# Altium project DIO_MCX.PrjPCB (part 1 of 2)
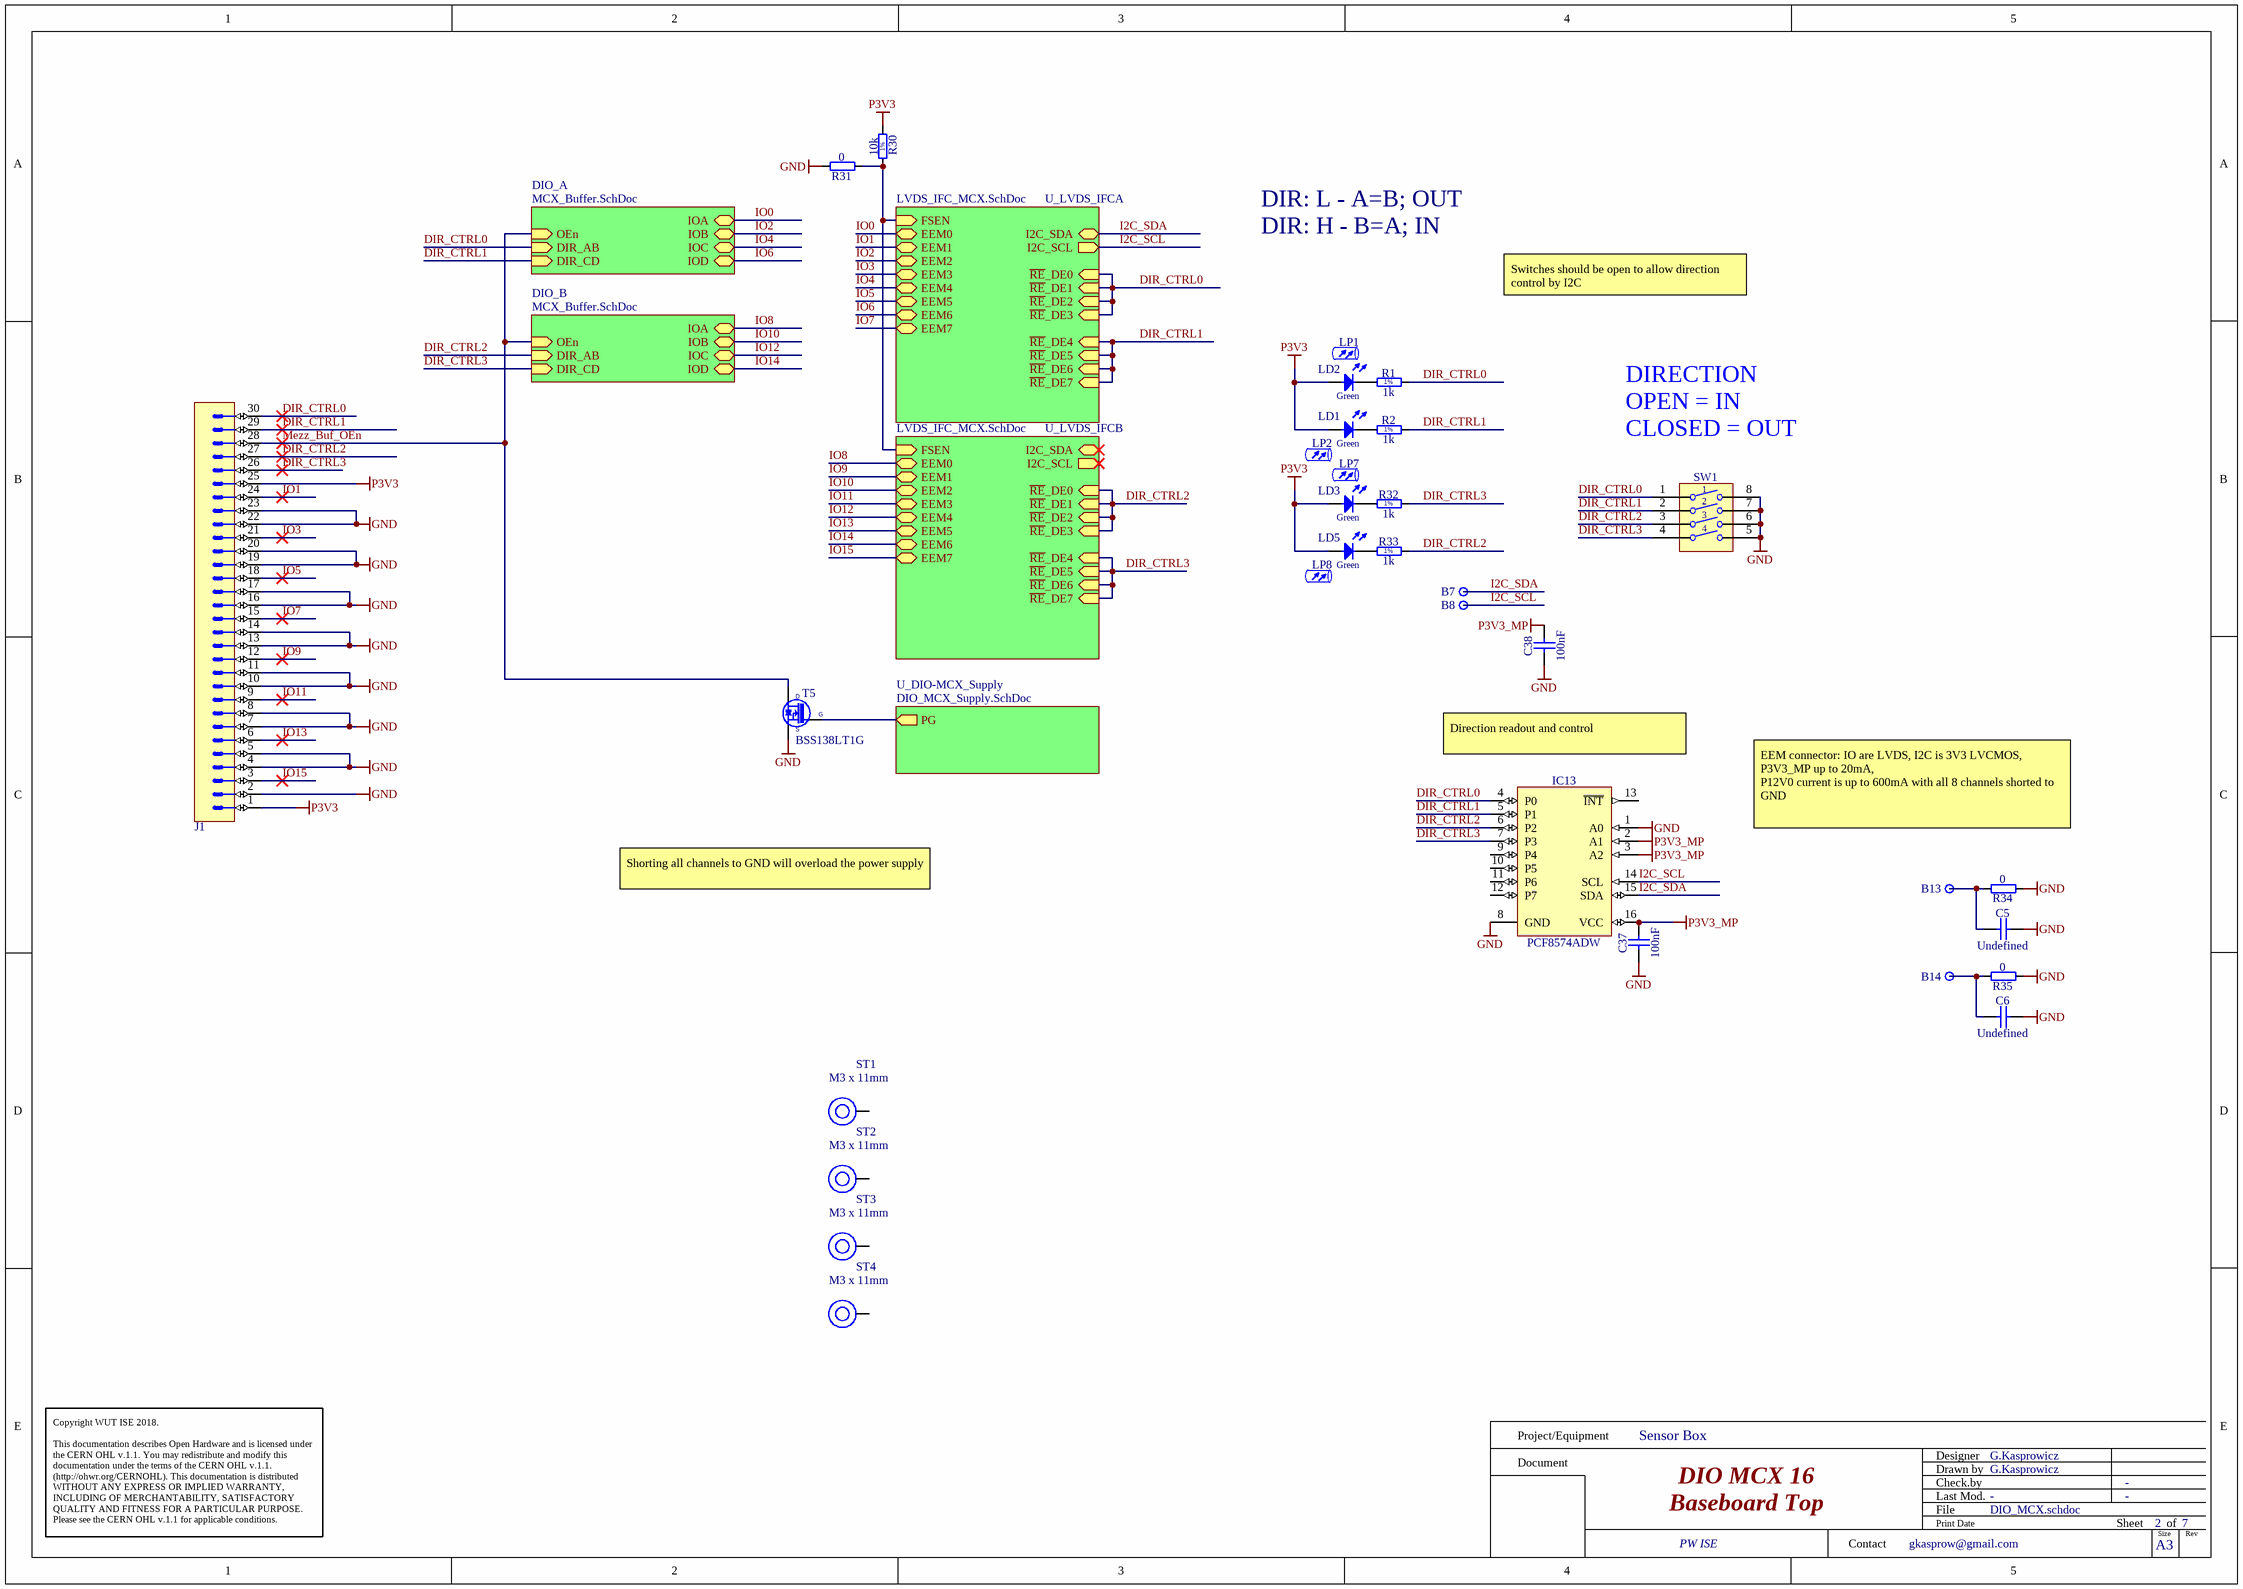
[diagram p0: DIO_MCX.schdoc]
P_version: 1.2.1
4 sheets, 224 parts. Net scope: hierarchical (ports join the sheet entries above them; power ports are global).
Board file: DIO_MCX.PCBDOC
Sheets:
  DIO_MCX.schdoc
    U_DIO-MCX_Supply = DIO_MCX_Supply.SchDoc
    U_LVDS_IFCA = LVDS_IFC_MCX.SchDoc
    U_LVDS_IFCB = LVDS_IFC_MCX.SchDoc
    DIO_A = MCX_Buffer.SchDoc
    DIO_B = MCX_Buffer.SchDoc

## Sheet DIO_MCX.schdoc: DIO MCX 16
size 420 x 297 mm; EDA_Number: ARTIQ; Projet: ARTIQ/SINARA Kasli Subsystem; Author: G.Kasprowicz; CompanyName: WUT ISE; DrawnBy: G.Kasprowicz; Organization: WUT ISE; Address1: PW ISE; Address2: Nowowiejska 15/19 00-665 Warsaw; Address3: gkasprow@gmail.com; DocumentNumber: 2; Revision: 1.2.1; SheetNumber: 2; SheetTotal: 7; ModifiedBy: -; CheckedDate: -; Title2: Baseboard Top; DivGrp: WUT ISE; Designer: G.Kasprowicz; ModifiedDate: -; ProjectName: Sensor Box

### Parts
B7  Plated Hole  [c130h60]  (value not drawn)
B8  Plated Hole  [c130h60]  (value not drawn)
B13  Plated Hole  [MTG270_500]  (value not drawn)
B14  Plated Hole  [MTG270_500]  (value not drawn)
C5  Undefined  [CAPC2012X135N]
C6  Undefined  [CAPC2012X135N]
C37  100nF  [CAPC1005X55N]
C38  100nF  [CAPC1005X55N]
IC13  PCF8574ADW  [SOIC127P1030X265-16N]
J1  (no value)  [3M_N2530-6002RB]
LD1  Green  [LED_DIALIGHT_551-1307F]
LD2  Green  [LED_DIALIGHT_551-1307F]
LD3  Green  [LED_DIALIGHT_551-1307F]
LD5  Green  [LED_DIALIGHT_551-1307F]
LP1  (no value)  [FIX&FASTEN-LEMB2-8V0-F]
LP2  (no value)  [FIX&FASTEN-LEMB2-8V0-F]
LP7  (no value)  [FIX&FASTEN-LEMB2-8V0-F]
LP8  (no value)  [FIX&FASTEN-LEMB2-8V0-F]
R1  1k  [RESC1005X40N]
R2  1k  [RESC1005X40N]
R30  10k  [RESC1005X40N]
R31  0  [RESC1608X55N]
R32  1k  [RESC1005X40N]
R33  1k  [RESC1005X40N]
R34  0  [RESC1608X55N]
R35  0  [RESC1608X55N]
ST1  M3 x 11mm  [9774110360]
ST2  M3 x 11mm  [9774110360]
ST3  M3 x 11mm  [9774110360]
ST4  M3 x 11mm  [9774110360]
SW1  Switch  [SW_OMRON_A6S-4102-H]  (value not drawn)
T5  BSS138LT1G  [SOT95P240X110-3N]

### Sub-sheets
DIO_A = MCX_Buffer.SchDoc: IOA (bidir), IOB (bidir), IOC (bidir), IOD (bidir), DIR_AB (in), OEn (in), DIR_CD (in)
DIO_B = MCX_Buffer.SchDoc: OEn (in), DIR_AB (in), DIR_CD (in), IOA (bidir), IOB (bidir), IOC (bidir), IOD (bidir)
U_DIO-MCX_Supply = DIO_MCX_Supply.SchDoc: PG (out)
U_LVDS_IFCA = LVDS_IFC_MCX.SchDoc: ~{RE}_DE1 (in), ~{RE}_DE2 (in), ~{RE}_DE3 (in), ~{RE}_DE4 (in), ~{RE}_DE5 (in), ~{RE}_DE6 (in), ~{RE}_DE7 (in), ~{RE}_DE0 (in), I2C_SDA (bidir), I2C_SCL (out), EEM1 (bidir), EEM2 (bidir), EEM5 (bidir), EEM6 (bidir), EEM7 (bidir), EEM3 (bidir), EEM4 (bidir), EEM0 (bidir), FSEN (in)
U_LVDS_IFCB = LVDS_IFC_MCX.SchDoc: I2C_SDA (bidir), I2C_SCL (out), EEM1 (bidir), EEM2 (bidir), EEM5 (bidir), EEM6 (bidir), EEM7 (bidir), EEM3 (bidir), EEM4 (bidir), EEM0 (bidir), ~{RE}_DE1 (in), ~{RE}_DE2 (in), ~{RE}_DE3 (in), ~{RE}_DE4 (in), ~{RE}_DE5 (in), ~{RE}_DE6 (in), ~{RE}_DE7 (in), ~{RE}_DE0 (in), FSEN (in)

### Nets
GND: C5.2 C6.2 C37.1 C38.1 IC13.1(A0) IC13.8(GND) J1.2 J1.4 J1.5 J1.7 J1.8 J1.10 J1.11 J1.13 J1.14 J1.16 J1.17 J1.19 J1.20 J1.22 J1.23 R31.2 R34.1 R35.1 SW1.5 SW1.6 SW1.7 SW1.8 T5.2(S)
P3V3: J1.1 J1.25 LD1.2(A) LD2.2(A) LD3.2(A) LD5.2(A) R30.2
P3V3_MP: C37.2 C38.2 IC13.2(A1) IC13.3(A2) IC13.16(VCC)
DIR_CTRL0: IC13.4(P0) J1.30 R1.2 SW1.1 ; sheet U_LVDS_IFCA/~{RE}_DE1, sheet U_LVDS_IFCA/~{RE}_DE2, sheet U_LVDS_IFCA/~{RE}_DE3, sheet U_LVDS_IFCA/~{RE}_DE0, sheet DIO_A/DIR_AB
DIR_CTRL1: IC13.5(P1) J1.29 R2.2 SW1.2 ; sheet U_LVDS_IFCA/~{RE}_DE4, sheet U_LVDS_IFCA/~{RE}_DE5, sheet U_LVDS_IFCA/~{RE}_DE6, sheet U_LVDS_IFCA/~{RE}_DE7, sheet DIO_A/DIR_CD
DIR_CTRL2: IC13.6(P2) J1.27 R33.2 SW1.3 ; sheet U_LVDS_IFCB/~{RE}_DE1, sheet U_LVDS_IFCB/~{RE}_DE2, sheet U_LVDS_IFCB/~{RE}_DE3, sheet U_LVDS_IFCB/~{RE}_DE0, sheet DIO_B/DIR_AB
DIR_CTRL3: IC13.7(P3) J1.26 R32.2 SW1.4 ; sheet U_LVDS_IFCB/~{RE}_DE4, sheet U_LVDS_IFCB/~{RE}_DE5, sheet U_LVDS_IFCB/~{RE}_DE6, sheet U_LVDS_IFCB/~{RE}_DE7, sheet DIO_B/DIR_CD
FSEN: R30.1 R31.1 ; sheet U_LVDS_IFCA/FSEN, sheet U_LVDS_IFCB/FSEN
I2C_SCL: B8.1 IC13.14(SCL) ; sheet U_LVDS_IFCA/I2C_SCL
I2C_SDA: B7.1 IC13.15(SDA) ; sheet U_LVDS_IFCA/I2C_SDA
IO0: sheet U_LVDS_IFCA/EEM0, sheet DIO_A/IOA
IO1: J1.24 ; sheet U_LVDS_IFCA/EEM1
IO2: sheet U_LVDS_IFCA/EEM2, sheet DIO_A/IOB
IO3: J1.21 ; sheet U_LVDS_IFCA/EEM3
IO4: sheet U_LVDS_IFCA/EEM4, sheet DIO_A/IOC
IO5: J1.18 ; sheet U_LVDS_IFCA/EEM5
IO6: sheet U_LVDS_IFCA/EEM6, sheet DIO_A/IOD
IO7: J1.15 ; sheet U_LVDS_IFCA/EEM7
IO8: sheet U_LVDS_IFCB/EEM0, sheet DIO_B/IOA
IO9: J1.12 ; sheet U_LVDS_IFCB/EEM1
IO10: sheet U_LVDS_IFCB/EEM2, sheet DIO_B/IOB
IO11: J1.9 ; sheet U_LVDS_IFCB/EEM3
IO12: sheet U_LVDS_IFCB/EEM4, sheet DIO_B/IOC
IO13: J1.6 ; sheet U_LVDS_IFCB/EEM5
IO14: sheet U_LVDS_IFCB/EEM6, sheet DIO_B/IOD
IO15: J1.3 ; sheet U_LVDS_IFCB/EEM7
Mezz_Buf_OEn: J1.28 T5.3(D) ; sheet DIO_A/OEn, sheet DIO_B/OEn
PG: T5.1(G) ; sheet U_DIO-MCX_Supply/PG
NetB13_1: B13.1 C5.1 R34.2
NetB14_1: B14.1 C6.1 R35.2
NetLD1_1: LD1.1(C) R2.1
NetLD2_1: LD2.1(C) R1.1
NetLD3_1: LD3.1(C) R32.1
NetLD5_1: LD5.1(C) R33.1

Not connected (* = marked no-connect by the designer): IC13 9(P4) 10(P5) 11(P6) 12(P7) 13(~{INT}); ST1 1; ST2 1; ST3 1; ST4 1

### Notes on the sheet
- DIR: L - A=B; OUT
- DIR: H - B=A; IN
- Switches should be open to allow direction control by I2C
- DIRECTION
- OPEN = IN
- CLOSED = OUT
- Direction readout and control
- EEM connector: IO are LVDS, I2C is 3V3 LVCMOS, P3V3_MP up to 20mA,
  P12V0 current is up to 600mA with all 8 channels shorted to GND
- Shorting all channels to GND will overload the power supply
- Project/Equipment
- Document
- Designer
- Drawn by
- Check.by
- Copyright WUT ISE 2018.
  This documentation describes Open Hardware and is licensed under the CERN OHL v.1.1. You may redistribute and modify this documentation under the terms of the CERN OHL v.1.1. (http://ohwr.org/CERNOHL). This documentation is distributed WITHOUT ANY EXPRESS OR IMPLIED WARRANTY, INCLUDING OF MERCHANTABILITY, SATISFACTORY QUALITY AND FITNESS FOR A PARTICULAR PURPOSE. Please see the CERN OHL v.1.1 for applicable conditions.
- Contact
- File
- Last Mod.
- Print Date
- Sheet
- Size
- A3
- of
- Rev
- (in symbol R0402_1K_1%_0.0625W_100PPM) 1%
- (in symbol R0402_10K_1%_0.0625W_100PPM) 1%

### Library data of the parts
B7 B8 = PLATED_HOLE0.6_PAD1.3: Single Terminal Socket; Part Description: Plated Through Hole: Hole Dia.=0.6mm Pad Dia.=1.3mm; Mounted: No; Part Number: PLATED_HOLE0.6_PAD1.3; Component Kind: Standard (No BOM); Component Type: Standard (No BOM); Pin Count: 1; Family: Plated Hole; Socket: No; SMD: No; Sense: No; Status: None; ComponentHeight: 0mm; HelpURL: Undefined; Author: CERN DEM MR; CreateDate: 02.03.2016; LatestRevisionDate: 02.03.2016; PackageDescription: Plated Through Hole: Hole Dia.=0.6mm Pad Dia.=1.3mm
B13 B14 = PLATED_HOLE2.7_PAD5.0: Single Terminal Socket; Part Description: Plated Through Hole: Hole Dia.=2.7mm Pad Dia.=5.0mm; Mounted: No; Part Number: PLATED_HOLE2.7_PAD5.0; Component Kind: Standard (No BOM); Component Type: Standard (No BOM); Pin Count: 1; Family: Plated Hole; Socket: No; SMD: No; Sense: No; Status: None; ComponentHeight: 0mm; HelpURL: Undefined; Author: CERN DEM JMW; CreateDate: 27.09.2011; LatestRevisionDate: 27.09.2011; PackageDescription: Plated Through Hole: Hole Dia.=2.7mm Pad Dia.=5.0mm
C5 C6 = CC0805_NO-VALUE: Non-polarised capacitor; Part Description: Reserved Footprint For 0805(2012) Chip Ceramic Capacitor; Mounted: No; Part Number: CC0805_NO-VALUE; Component Kind: Standard; Component Type: Standard; Pin Count: 2; Value: Undefined; Status: None; Manufacturer: Undefined; Manufacturer Part Number: CC0805_NO-VALUE; Case: 0805; Socket: No; SMD: Yes; Sense: No; Manufacturer1 ComponentHeight: 1.35mm; HelpURL: Undefined; Author: CERN DEM JLC; CreateDate: 10.12.2008; LatestRevisionDate: 11.09.2013
C37 C38 = CC0402_100NF_16V_10%_X5R: Non-polarised capacitor; Part Description: SMD Multilayer Chip Ceramic Capacitor; Manufacturer: GENERIC; Manufacturer1 Part Number: GRM155R61C104KA88D; Voltage: 16V; TC: X5R; Tolerance: ±10%; Part Number: CC0402_100NF_16V_10%_X5R; Component Kind: Standard; Component Type: Standard; Pin Count: 2; Value: 100nF; Status: None; Manufacturer Part Number: CC0402_100NF_16V_10%_X5R; Case: 0402; Mounted: Yes; Socket: No; SMD: Yes; Sense: No; Manufacturer1 Example: MURATA; Manufacturer1 ComponentHeight: 0.55mm; HelpURL: \\cern.ch\dfs\Applications\Altium\Datasheets\CC0402_X5R_MURATA_GRM.pdf; Author: CERN DEM JLC; CreateDate: 10.12.2013; LatestRevisionDate: 10.12.2013
IC13 = PCF8574ADW: Remote 8-bit I/O Expander For I2C Bus; Manufacturer: TEXAS INSTRUMENTS; PressFit: No; Bonding: No; Part Number: PCF8574ADW; Component Kind: Standard; Component Type: Standard; Device: PCF8574ADW; PackageDescription: SOIC 16, Pitch 1.27mm - Body 7.5x10.3mm, IPC Medium Density; Part Description: Remote 8-bit I/O Expander For I2C Bus; Manufacturer Part Number: PCF8574ADW; Pin Count: 16; Case: SOIC16W; Mounted: Yes; Socket: No; SMD: Yes; Sense: No; ComponentHeight: 2.65mm; Author: CERN DEM JLC; HelpURL: \\cern.ch\dfs\Applications\Altium\Datasheets\PCF8574ADW.pdf; CreateDate: 01.11.2012; LatestRevisionDate: 01.11.2012
J1 = 3M_N2530-6002RB: Connector 30 Male; Part Description: 30 Contacts - Straight .100'' x .100'' Low Profile Four-Wall Header, 2500 Series; Manufacturer: 3M; PressFit: No; Part Number: 3M_N2530-6002RB; Component Kind: Standard; Component Type: Standard; Pin Count: 30; Family: Header 30; Mounted: Yes; Socket: No; SMD: No; Sense: No; Status: None; Manufacturer Part Number: N2530-6002RB; ComponentHeight: 10.03mm; HelpURL: \\cern.ch\dfs\Applications\Altium\Datasheets\3M_N2530-6002RB.pdf; Author: CERN DEM JLC; CreateDate: 11.02.2009; LatestRevisionDate: 11.08.2009
LD1-LD3 LD5 = LED_DIALIGHT_551-1307F: LED Green 1C 2A; Part Description: Single 3mm Green LED CBI® Circuit Board Indicator; PressFit: No; Bonding: No; Part Number: LED_DIALIGHT_551-1307F; Component Kind: Standard; Component Type: Standard; Color: Green; PackageDescription: Single 3mm Green LED, Body 6.35x4.32mm, Pin spacing 2.54mm; Manufacturer: DIALIGHT; Manufacturer Part Number: 551-1307F; Pin Count: 2; Mounted: Yes; Socket: No; SMD: No; Sense: No; ComponentHeight: 7.11mm; HelpURL: \\cern.ch\dfs\Applications\Altium\Datasheets\LED_DIALIGHT_551-1307F.pdf; Author: CERN DEM JLC; CreateDate: 13.01.2009; LatestRevisionDate: 17.03.2010
LP1 LP2 LP7 LP8 = LED Light_pipe_2.3x8mm: Part Description: Right Angle Single Element 2.3x8mm Round Lightpipe; Manufacturer: FIX&FASTEN; Manufacturer Part Number: FIX-LEMB2-8V0-F; PressFit: No; Bonding: No; Part Number: FIX&FASTEN-LEMB2-8V0-F; Component Kind: Accessories; Component Type: Standard; PackageDescription: Right Angle Single Element 2.3mmx8mm Round Lightpipe; Pin Count: 0; Mounted: Yes; Socket: No; SMD: No; Sense: No; ComponentHeight: 2.3mm; HelpURL: \\cern.ch\dfs\Applications\Altium\Datasheets\LEDLP_DIALIGHT_515-1049F.pdf; Author: GK; CreateDate: 24.01.2017; LatestRevisionDate: 24.01.2017
R1 R2 R32 R33 = R0402_1K_1%_0.0625W_100PPM: Resistor - 1%; Part Description: General Purpose Thick Film Chip Resistor; Manufacturer: GENERIC; Manufacturer1 Part Number: 232270671002L; TC: ±100ppm/°C; PressFit: No; Part Number: R0402_1K_1%_0.0625W_100PPM; Component Kind: Standard; Component Type: Standard; Pin Count: 2; Value: 1k; Status: Not Recommended; Power: 0.0625W; Tolerance: ±1%; Manufacturer Part Number: R0402_1K_1%_0.0625W_100PPM; Case: 0402; Mounted: Yes; Sense: No; Socket: No; SMD: Yes; Manufacturer1 Example: YAGEO PHYCOMP; Manufacturer1 ComponentHeight: 0.4mm; HelpURL: \\cern.ch\dfs\Applications\Altium\Datasheets\R0402_Phycomp_RC0402.pdf; Author: CERN DEM JLC; CreateDate: 03.12.2007; LatestRevisionDate: 17.10.2012
R30 = R0402_10K_1%_0.0625W_100PPM: Resistor - 1%; Part Description: General Purpose Thick Film Chip Resistor; Manufacturer: GENERIC; Manufacturer1 Part Number: 232270671003L; TC: ±100ppm/°C; Part Number: R0402_10K_1%_0.0625W_100PPM; Component Kind: Standard; Component Type: Standard; Pin Count: 2; Value: 10k; Status: Not recommended; Power: 0.0625W; Tolerance: ±1%; Manufacturer Part Number: R0402_10K_1%_0.0625W_100PPM; Case: 0402; Mounted: Yes; Sense: No; Socket: No; SMD: Yes; Manufacturer1 Example: YAGEO PHYCOMP; Manufacturer1 ComponentHeight: 0.4mm; HelpURL: \\cern.ch\dfs\Applications\Altium\Datasheets\R0402_Phycomp_RC0402.pdf; Author: CERN DEM JLC; CreateDate: 03.12.2007; LatestRevisionDate: 17.10.2012
R31 R34 R35 = R0603_0R_JUMPER: Resistor; Part Description: 1A (0.05R Max DC Resistance) Zero Ohm Jumper; Manufacturer: GENERIC; Manufacturer1 Part Number: NRC06Z0; PressFit: No; Part Number: R0603_0R_JUMPER; Component Kind: Standard; Component Type: Standard; Pin Count: 2; Value: 0; Status: Preferred; Manufacturer Part Number: R0603_0R_JUMPER; Case: 0603; Mounted: Yes; Sense: No; Socket: No; SMD: Yes; Manufacturer1 Example: NIC COMPONENT; Manufacturer1 ComponentHeight: 0.55mm; HelpURL: \\cern.ch\dfs\Applications\Altium\Datasheets\R0603_NIC_NRC.pdf; Author: CERN DEM JLC; CreateDate: 03.12.2007; LatestRevisionDate: 13.03.2008
ST1-ST4 = 9774110360R: WA-SMSI SMT Steel Spacer with internal Thread, OD 6mm, M3 x 11mm; Manufacturer: Wurth Elektronik; Inside Diameter: 4.2mm; Surface: Tin; Manufacturer Part Number: 9774110360R; ComponentLink1Description: Website Link; ComponentLink1URL: https://www.we-online.com/redexpert/article/9774110360R?ad; ComponentLink2Description: Datasheet Link; ComponentLink2URL: https://www.we-online.com/redexpert/spec/9774110360R?ad; Category: SMT Spacers; Match Code: WA-SMSI; Mount: Surface Mount; Operating Temperature Max: 150°C; Operating Temperature Min: -55°C; Packaging: Tape and Reel; Height: 11mm; Material: Steel; Outside Diameter: 6mm; Thread Size: M3
SW1 = SW_OMRON_A6S-4102-H: 4 Ways SPST DIP Switch; Part Description: 4 Ways SPST DIP Switch, White Flat Actuator with Seal Tape, Contact Rating 25mA 24VDC; Manufacturer: OMRON; PressFit: No; Part Number: SW_OMRON_A6S-4102-H; Component Kind: Standard; Component Type: Standard; Pin Count: 8; PackageDescription: Pitch 2.54mm, Body 11.3x6.4mm, 4 Ways SPST Surface-Mounting DIP Switch, OMRON A6S-H; Family: Switch; Mounted: Yes; Socket: No; SMD: Yes; Sense: No; Status: None; Manufacturer Part Number: A6S-4102-H; ComponentHeight: 3.8mm; HelpURL: \\cern.ch\dfs\Applications\Altium\Datasheets\SW_OMRON_A6S-4102-H.pdf; Author: CERN DEM JMW; CreateDate: 25.09.2008; LatestRevisionDate: 25.09.2008
T5 = BSS138LT1G: N-CHANNEL MOSFET WITH DIODE; Part Description: 50V 200mA N-Channel Enhancement Mode Field-Effect Transistor; Manufacturer: ON SEMICONDUCTOR; PressFit: No; Bonding: No; Part Number: BSS138LT1G; Component Kind: Standard; Component Type: Standard; Device: BSS138LT1G; PackageDescription: SOT23 3-Leads, Pitch 0.95mm - Body 1.4x3mm, IPC Medium Density; Manufacturer Part Number: BSS138LT1G; Pin Count: 3; Case: SOT23-3; Mounted: Yes; Socket: No; SMD: Yes; Sense: No; ComponentHeight: 1.11mm; HelpURL: \\cern.ch\dfs\Applications\Altium\Datasheets\BSS138LT1G.pdf; Author: CERN DEM JLC; CreateDate: 23.03.2009; LatestRevisionDate: 23.03.2009

## Sheet DIO_MCX_Supply.SchDoc: DIO MCX 16
size 420 x 297 mm; EDA_Number: ARTIQ; Projet: ARTIQ/SINARA Kasli Subsystem; Author: G.Kasprowicz; CompanyName: WUT ISE; DrawnBy: G.Kasprowicz; Organization: WUT ISE; Address1: PW ISE; Address2: Nowowiejska 15/19 00-665 Warsaw; Address3: gkasprow@gmail.com; DocumentNumber: 3; Revision: 1.2.1; SheetNumber: 3; SheetTotal: 7; ModifiedBy: -; CheckedDate: -; Title2: Power supply; DivGrp: WUT ISE; Designer: G.Kasprowicz; ModifiedDate: -; ProjectName: Sensor Box
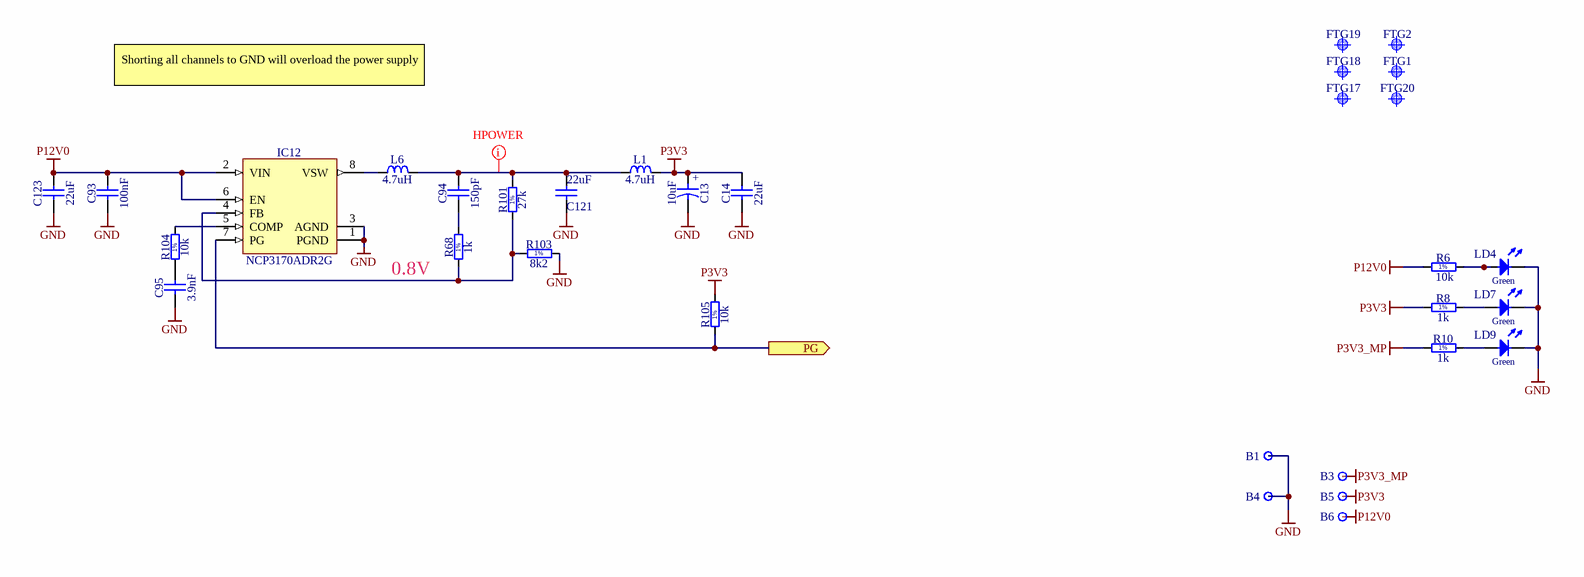
[diagram p1: DIO_MCX_Supply.SchDoc]

### Parts
B1  Plated Hole  [c130h60]  (value not drawn)
B3  Plated Hole  [c130h60]  (value not drawn)
B4  Plated Hole  [c130h60]  (value not drawn)
B5  Plated Hole  [c130h60]  (value not drawn)
B6  Plated Hole  [c130h60]  (value not drawn)
C13  10uF  [CAPAE430X540N]
C14  22uF  [CAPC2012X135N]
C93  100nF  [CAPC1005X55N]
C94  150pF  [CAPC1608X87N]
C95  3.9nF  [CAPC1608X87N]
C121  22uF  [CAPC2012X135N]
C123  22uF  [CAPC2012X135N]
FTG1  Use only in PCB  [FIDUCIAL_TOP_C100-200]  (value not drawn)
FTG2  Use only in PCB  [FIDUCIAL_TOP_C100-200]  (value not drawn)
FTG17  Use only in PCB  [FIDUCIAL_TOP_C100-200]  (value not drawn)
FTG18  Use only in PCB  [FIDUCIAL_TOP_S100-200]  (value not drawn)
FTG19  Use only in PCB  [FIDUCIAL_TOP_S100-200]  (value not drawn)
FTG20  Use only in PCB  [FIDUCIAL_TOP_S100-200]  (value not drawn)
IC12  NCP3170ADR2G  [SOIC127P600X175-8N]
L1  4.7uH  [IND_BOURNS_SRU8043]
L6  4.7uH  [IND_BOURNS_SRU8043]
LD4  Green  [LED_KINGBRIGHT_KPH-1608CGCK]  (value not drawn)
LD7  Green  [LED_KINGBRIGHT_KPH-1608CGCK]  (value not drawn)
LD9  Green  [LED_KINGBRIGHT_KPH-1608CGCK]  (value not drawn)
R6  10k  [RESC1005X40N]
R8  1k  [RESC1005X40N]
R10  1k  [RESC1005X40N]
R68  1k  [RESC1005X40N]
R101  27k  [RESC1005X40N]
R103  8k2  [RESC1005X40N]
R104  10k  [RESC1005X40N]
R105  10k  [RESC1005X40N]

### Ports
PG (out)

### Nets
GND: B1.1 B4.1 C13.2 C14.1 C93.1 C95.1 C121.1 C123.1 IC12.1(PGND) IC12.3(AGND) LD4.1(C) LD7.1(C) LD9.1(C) R103.2
P3V3: B5.1 C13.1 C14.2 L1.2 R8.1 R105.2
P3V3_MP: B3.1 R10.1
P12V0: B6.1 C93.2 C123.2 IC12.2(VIN) IC12.6(EN) R6.2
PG: IC12.7(PG) R105.1 ; port PG
NetC94_1: C94.1 R68.2
NetC94_2: C94.2 C121.2 L1.1 L6.2 R101.2
NetC95_2: C95.2 R104.1
NetIC12_4: IC12.4(FB) R68.1 R101.1 R103.1
NetIC12_5: IC12.5(COMP) R104.2
NetIC12_8: IC12.8(VSW) L6.1
NetLD4_2: LD4.2(A) R6.1
NetLD7_2: LD7.2(A) R8.2
NetLD9_2: LD9.2(A) R10.2

### Layout directives
net class Hpower; rule Routing Via Style [Pref Size = 0.7mm    Pref Hole Size = 0.5mm]; rule Width Constraint [Pref Width = 20mil    Min Width = 15mil    Max Width = 50mil]: NetC94_2

### Notes on the sheet
- Shorting all channels to GND will overload the power supply
- (near R68) 0.8V
- Project/Equipment
- Document
- Designer
- Drawn by
- Check.by
- Copyright WUT ISE 2018.
  This documentation describes Open Hardware and is licensed under the CERN OHL v.1.1. You may redistribute and modify this documentation under the terms of the CERN OHL v.1.1. (http://ohwr.org/CERNOHL). This documentation is distributed WITHOUT ANY EXPRESS OR IMPLIED WARRANTY, INCLUDING OF MERCHANTABILITY, SATISFACTORY QUALITY AND FITNESS FOR A PARTICULAR PURPOSE. Please see the CERN OHL v.1.1 for applicable conditions.
- Contact
- File
- Last Mod.
- Print Date
- Sheet
- Size
- A3
- of
- Rev
- (in symbol CAE430-540_10UF_16V_20%) +
- (in symbol R0402_1k_1%_0.0625W_100PPM) 1%
- (in symbol R0402_1K_1%_0.0625W_100PPM) 1%
- (in symbol R0402_8K2_1%_0.0625W_100PPM) 1%
- (in symbol R0402_10K_1%_0.0625W_100PPM) 1%
- (in symbol R0402_27K_1%_0.0625W_100PPM) 1%

### Library data of the parts
B1 B3-B6 = PLATED_HOLE0.6_PAD1.3: as B7 on sheet DIO_MCX; Part Number: PLATED_HOLE0.6_PAD1.3; Component Kind: Standard (No BOM); Component Type: Standard (No BOM); Pin Count: 1; Family: Plated Hole; Socket: No; SMD: No; Sense: No; Status: None; ComponentHeight: 0mm; HelpURL: Undefined; Author: CERN DEM MR; CreateDate: 02.03.2016; LatestRevisionDate: 02.03.2016; PackageDescription: Plated Through Hole: Hole Dia.=0.6mm Pad Dia.=1.3mm
C13 = CAE430-540_10UF_16V_20%: Polarised capacitor; Part Description: Aluminum Electrolytic SMT Capacitor; Manufacturer: PANASONIC; Manufacturer Part Number: EEEFK1C100AR; Voltage: 16V; Tolerance: ±20%; Part Number: CAE430-540_10UF_16V_20%; Component Kind: Standard; Component Type: Standard; Pin Count: 2; Value: 10uF; Status: Not Recommended; Case: B; Mounted: Yes; Socket: No; SMD: Yes; Sense: No; ComponentHeight: 5.8mm; HelpURL: \\cern.ch\dfs\Applications\Altium\Datasheets\CAE_PANASONIC_FK.pdf; Author: CERN DEM JLC; CreateDate: 03.12.2007; LatestRevisionDate: 05.11.2014
C14 C121 C123 = CC0805_22UF_16V_10%_X5R: Non-polarised capacitor; Part Description: SMD Multilayer Chip Ceramic Capacitor; Manufacturer: GENERIC; Manufacturer1 Part Number: C2012X5R1C226KT; Voltage: 16V; TC: X5R; Tolerance: ±10%; Part Number: CC0805_22UF_16V_10%_X5R; Component Kind: Standard; Component Type: Standard; Pin Count: 2; Value: 22uF; Status: Preferred; Manufacturer Part Number: CC0805_22UF_16V_10%_X5R; Case: 0805; Mounted: Yes; Socket: No; SMD: Yes; Sense: No; Manufacturer1 Example: TDK; Manufacturer1 ComponentHeight: 1.35mm; HelpURL: \\cern.ch\dfs\Applications\Altium\Datasheets\CC0805_X5R_TDK_C.pdf; Author: CERN DEM JLC; CreateDate: 25.10.2012; LatestRevisionDate: 25.10.2012
C93 = CC0402_100NF_16V_10%_X5R: as C37 on sheet DIO_MCX; Part Number: CC0402_100NF_16V_10%_X5R; Component Kind: Standard; Component Type: Standard; Pin Count: 2; Value: 100nF; Status: None; Manufacturer Part Number: CC0402_100NF_16V_10%_X5R; Case: 0402; Mounted: Yes; Socket: No; SMD: Yes; Sense: No; Manufacturer1 Example: MURATA; Manufacturer1 ComponentHeight: 0.55mm; HelpURL: \\cern.ch\dfs\Applications\Altium\Datasheets\CC0402_X5R_MURATA_GRM.pdf; Author: CERN DEM JLC; CreateDate: 10.12.2013; LatestRevisionDate: 10.12.2013
C94 = CC0603_150PF_50V_1%_NP0: Non-polarised capacitor; Part Description: SMD Multilayer Chip Ceramic Capacitor; Manufacturer: GENERIC; Manufacturer1 Part Number: CC0603FRNPO9BN151; Voltage: 50V; TC: C0G/NP0; Tolerance: ±1%; Part Number: CC0603_150PF_50V_1%_NP0; Component Kind: Standard; Component Type: Standard; Pin Count: 2; Value: 150pF; Status: None; Manufacturer Part Number: CC0603_150PF_50V_1%_NP0; Case: 0603; Mounted: Yes; Socket: No; SMD: Yes; Sense: No; Manufacturer1 Example: PHYCOMP; Manufacturer1 ComponentHeight: 0.7mm; HelpURL: \\cern.ch\dfs\Applications\Altium\Datasheets\CC0805_NP0_PHYCOMP_16VTO50V.pdf; Author: CERN DEM MR; CreateDate: 17.02.2016; LatestRevisionDate: 17.02.2016
C95 = CC0603_3.9NF_50V_5%_X7R: Non-polarised capacitor; Part Description: SMD Multilayer Chip Ceramic Capacitor; Manufacturer: GENERIC; Manufacturer1 Part Number: 223858615631; Voltage: 50V; TC: X7R; Tolerance: ±5%; Part Number: CC0603_3.9NF_50V_5%_X7R; Component Kind: Standard; Component Type: Standard; Pin Count: 2; Value: 3.9nF; Status: Preferred; Manufacturer Part Number: CC0603_3.9NF_50V_5%_X7R; Case: 0603; Mounted: Yes; Socket: No; SMD: Yes; Sense: No; Manufacturer1 Example: PHYCOMP; Manufacturer1 ComponentHeight: 0.87mm; HelpURL: \\cern.ch\dfs\Applications\Altium\Datasheets\CC0603_X7R_PHYCOMP.pdf; Author: CERN DEM JLC; CreateDate: 03.12.2007; LatestRevisionDate: 03.12.2007
FTG1 FTG2 FTG17 = FIDUCIAL_TARGET_C100-200: Fiducial Target; Part Description: Round Fiducial Target, Top Layer, 1.0mm, Top Solder 2.0mm, Keepout =2.0mm; Mounted: No; Part Number: FIDUCIAL_TARGET_C100-200; Component Kind: Standard (No BOM); Component Type: Standard (No BOM); Pin Count: 1; Family: Fiducial; Socket: No; SMD: Yes; Sense: No; Status: None; ComponentHeight: 0mm; HelpURL: Undefined; Author: CERN DEM JLC; CreateDate: 09.02.2010; LatestRevisionDate: 04.04.2012; PackageDescription: Round Fiducial Target, Top Layer, 1.0mm, Top Solder 2.0mm, Keepout =2.0mm
FTG18-FTG20 = FIDUCIAL_TARGET_S100-200: Fiducial Target; Part Description: Square Fiducial Target, Top Layer, 1.0mm, Top Solder 2.0mm, Keepout =2.0mm; Mounted: No; Part Number: FIDUCIAL_TARGET_S100-200; Component Kind: Standard (No BOM); Component Type: Standard (No BOM); Pin Count: 1; Family: Fiducial; Socket: No; SMD: Yes; Sense: No; Status: None; ComponentHeight: 0mm; HelpURL: Undefined; Author: CERN DEM JLC; CreateDate: 09.02.2010; LatestRevisionDate: 04.04.2012; PackageDescription: Square Fiducial Target, Top Layer, 1.0mm, Top Solder 2.0mm, Keepout =2.0mm
IC12 = NCP3170ADR2G: Synchronous PWM Switching Converter; Manufacturer: ON SEMICONDUCTOR; PressFit: No; Bonding: No; Part Number: NCP3170ADR2G; Component Kind: Standard; Component Type: Standard; Device: NCP3170ADR2G; PackageDescription: SOIC 8, Pitch 1.27mm - Body 4x5mm, IPC Medium Density; Part Description: Synchronous PWM Switching Converter; Manufacturer Part Number: NCP3170ADR2G; Pin Count: 8; Case: SOIC8; Mounted: Yes; Socket: No; SMD: Yes; Sense: No; ComponentHeight: 1.75mm; Author: CERN DEM MR; HelpURL: \\cern.ch\dfs\Applications\Altium\Datasheets\NCP3170ADR2G.pdf; CreateDate: 30.05.2016; LatestRevisionDate: 30.05.2016
L1 L6 = IND_4.7UH_30%_BOURNS_SRU8043: Power Shielded  4.7uH 30% 4.6A; Part Description: Shielded SMD Power Inductor; Manufacturer: BOURNS; Manufacturer Part Number: SRU8043-4R7Y; Resistance: 0.0174R; Part Number: IND_4.7UH_30%_BOURNS_SRU8043; Component Kind: Standard; Component Type: Standard; Pin Count: 2; Value: 4.7uH; Status: None; Power: 4.6A; Tolerance: ±30%; Mounted: Yes; Socket: No; SMD: Yes; Sense: No; ComponentHeight: 4.6mm; HelpURL: \\cern.ch\dfs\Applications\Altium\Datasheets\IND_BOURNS_SRU8043.pdf; Author: GK; CreateDate: 06.08.2015; LatestRevisionDate: 06.08.2015
LD4 LD7 LD9 = LED_KINGBRIGHT_KPH-1608CGCK: LED Green 1C 2A; Part Description: SMD Green LED, Case 1.6mmX0.8mm(0603), 0.65mm Thickness; PressFit: No; Bonding: No; Part Number: LED_KINGBRIGHT_KPH-1608CGCK; Component Kind: Standard; Component Type: Standard; Color: Green; PackageDescription: SMT Green LED, Case 0603, Body L 1.6 x W 0.8mm H 0.65mm; Manufacturer: KINGBRIGHT; Manufacturer Part Number: KPH-1608CGCK; Pin Count: 2; Mounted: Yes; Socket: No; SMD: Yes; Sense: No; ComponentHeight: 0.65mm; HelpURL: \\cern.ch\dfs\Applications\Altium\Datasheets\LED_KINGBRIGHT_KPH-1608CGCK.pdf; Author: CERN DEM JLC; CreateDate: 03.07.2017; LatestRevisionDate: 03.07.2017
R6 = R0402_10K_1%_0.0625W_100PPM: as R30 on sheet DIO_MCX; Part Number: R0402_10K_1%_0.0625W_100PPM; Component Kind: Standard; Component Type: Standard; Pin Count: 2; Value: 10k; Status: Not recommended; Power: 0.0625W; Tolerance: ±1%; Manufacturer Part Number: R0402_10K_1%_0.0625W_100PPM; Case: 0402; Mounted: Yes; Sense: No; Socket: No; SMD: Yes; Manufacturer1 Example: YAGEO PHYCOMP; Manufacturer1 ComponentHeight: 0.4mm; HelpURL: \\cern.ch\dfs\Applications\Altium\Datasheets\R0402_Phycomp_RC0402.pdf; Author: CERN DEM JLC; CreateDate: 03.12.2007; LatestRevisionDate: 17.10.2012
R8 R10 = R0402_1k_1%_0.0625W_100PPM: Resistor - 1%; Part Description: General Purpose Thick Film Chip Resistor; Manufacturer: GENERIC; Manufacturer1 Part Number: 232270671002L; TC: ±100ppm/°C; PressFit: No; Part Number: R0402_1K_1%_0.0625W_100PPM; Component Kind: Standard; Component Type: Standard; Pin Count: 2; Value: 1k; Status: Not Recommended; Power: 0.0625W; Tolerance: ±1%; Manufacturer Part Number: R0402_1K_1%_0.0625W_100PPM; Case: 0402; Mounted: Yes; Sense: No; Socket: No; SMD: Yes; Manufacturer1 Example: YAGEO PHYCOMP; Manufacturer1 ComponentHeight: 0.4mm; HelpURL: \\cern.ch\dfs\Applications\Altium\Datasheets\R0402_Phycomp_RC0402.pdf; Author: CERN DEM JLC; CreateDate: 03.12.2007; LatestRevisionDate: 17.10.2012
R68 = R0402_1K_1%_0.0625W_100PPM: as R1 on sheet DIO_MCX; Part Number: R0402_1K_1%_0.0625W_100PPM; Component Kind: Standard; Component Type: Standard; Pin Count: 2; Value: 1k; Status: Not Recommended; Power: 0.0625W; Tolerance: ±1%; Manufacturer Part Number: R0402_1K_1%_0.0625W_100PPM; Case: 0402; Mounted: Yes; Sense: No; Socket: No; SMD: Yes; Manufacturer1 Example: YAGEO PHYCOMP; Manufacturer1 ComponentHeight: 0.4mm; HelpURL: \\cern.ch\dfs\Applications\Altium\Datasheets\R0402_Phycomp_RC0402.pdf; Author: CERN DEM JLC; CreateDate: 03.12.2007; LatestRevisionDate: 17.10.2012
R101 = R0402_27K_1%_0.0625W_100PPM: Resistor - 1%; Part Description: General Purpose Thick Film Chip Resistor; Manufacturer: GENERIC; Manufacturer1 Part Number: 232270672703L; TC: ±100ppm/°C; PressFit: No; Part Number: R0402_27K_1%_0.0625W_100PPM; Component Kind: Standard; Component Type: Standard; Pin Count: 2; Value: 27k; Status: Not Recommended; Power: 0.0625W; Tolerance: ±1%; Manufacturer Part Number: R0402_27K_1%_0.0625W_100PPM; Case: 0402; Mounted: Yes; Sense: No; Socket: No; SMD: Yes; Manufacturer1 Example: YAGEO PHYCOMP; Manufacturer1 ComponentHeight: 0.4mm; HelpURL: \\cern.ch\dfs\Applications\Altium\Datasheets\R0402_Phycomp_RC0402.pdf; Author: CERN DEM JLC; CreateDate: 03/12/2007; LatestRevisionDate: 17/10/2012
R103 = R0402_8K2_1%_0.0625W_100PPM: Resistor - 1%; Part Description: General Purpose Thick Film Chip Resistor; Manufacturer: GENERIC; Manufacturer1 Part Number: 232270678202L; TC: ±100ppm/°C; PressFit: No; Part Number: R0402_8K2_1%_0.0625W_100PPM; Component Kind: Standard; Component Type: Standard; Pin Count: 2; Value: 8k2; Status: Not Recommended; Power: 0.0625W; Tolerance: ±1%; Manufacturer Part Number: R0402_8K2_1%_0.0625W_100PPM; Case: 0402; Mounted: Yes; Sense: No; Socket: No; SMD: Yes; Manufacturer1 Example: YAGEO PHYCOMP; Manufacturer1 ComponentHeight: 0.4mm; HelpURL: \\cern.ch\dfs\Applications\Altium\Datasheets\R0402_Phycomp_RC0402.pdf; Author: CERN DEM JLC; CreateDate: 03.12.2007; LatestRevisionDate: 17.10.2012
R104 R105 = R0402_10K_1%_0.0625W_100PPM: Resistor - 1%; Part Description: General Purpose Thick Film Chip Resistor; Manufacturer: GENERIC; Manufacturer1 Part Number: 232270671003L; TC: ±100ppm/°C; PressFit: No; Part Number: R0402_10K_1%_0.0625W_100PPM; Component Kind: Standard; Component Type: Standard; Pin Count: 2; Value: 10k; Status: Not Recommended; Power: 0.0625W; Tolerance: ±1%; Manufacturer Part Number: R0402_10K_1%_0.0625W_100PPM; Case: 0402; Mounted: Yes; Sense: No; Socket: No; SMD: Yes; Manufacturer1 Example: YAGEO PHYCOMP; Manufacturer1 ComponentHeight: 0.4mm; HelpURL: \\cern.ch\dfs\Applications\Altium\Datasheets\R0402_Phycomp_RC0402.pdf; Author: CERN DEM JLC; CreateDate: 03.12.2007; LatestRevisionDate: 17.10.2012

## Sheet LVDS_IFC_MCX.SchDoc: DIO MCX 16
size 420 x 297 mm; EDA_Number: ARTIQ; Projet: ARTIQ/SINARA; Author: G.Kasprowicz; CompanyName: WUT ISE; DrawnBy: G.Kasprowicz; Organization: WUT ISE; Address1: PW ISE; Address2: Nowowiejska 15/19 00-665 Warsaw; Address3: gkasprow@gmail.com; DocumentNumber: 4; Revision: 1.2.1; SheetNumber: 4; SheetTotal: 7; ModifiedBy: -; CheckedDate: -; Title2: LVDS Interface; DivGrp: WUT ISE; Designer: G.Kasprowicz; ModifiedDate: -; ProjectName: Sensor Box
Used 2 times, as channels U_LVDS_IFCA, U_LVDS_IFCB. Parts and nets are listed once, with the designators drawn on the sheet.
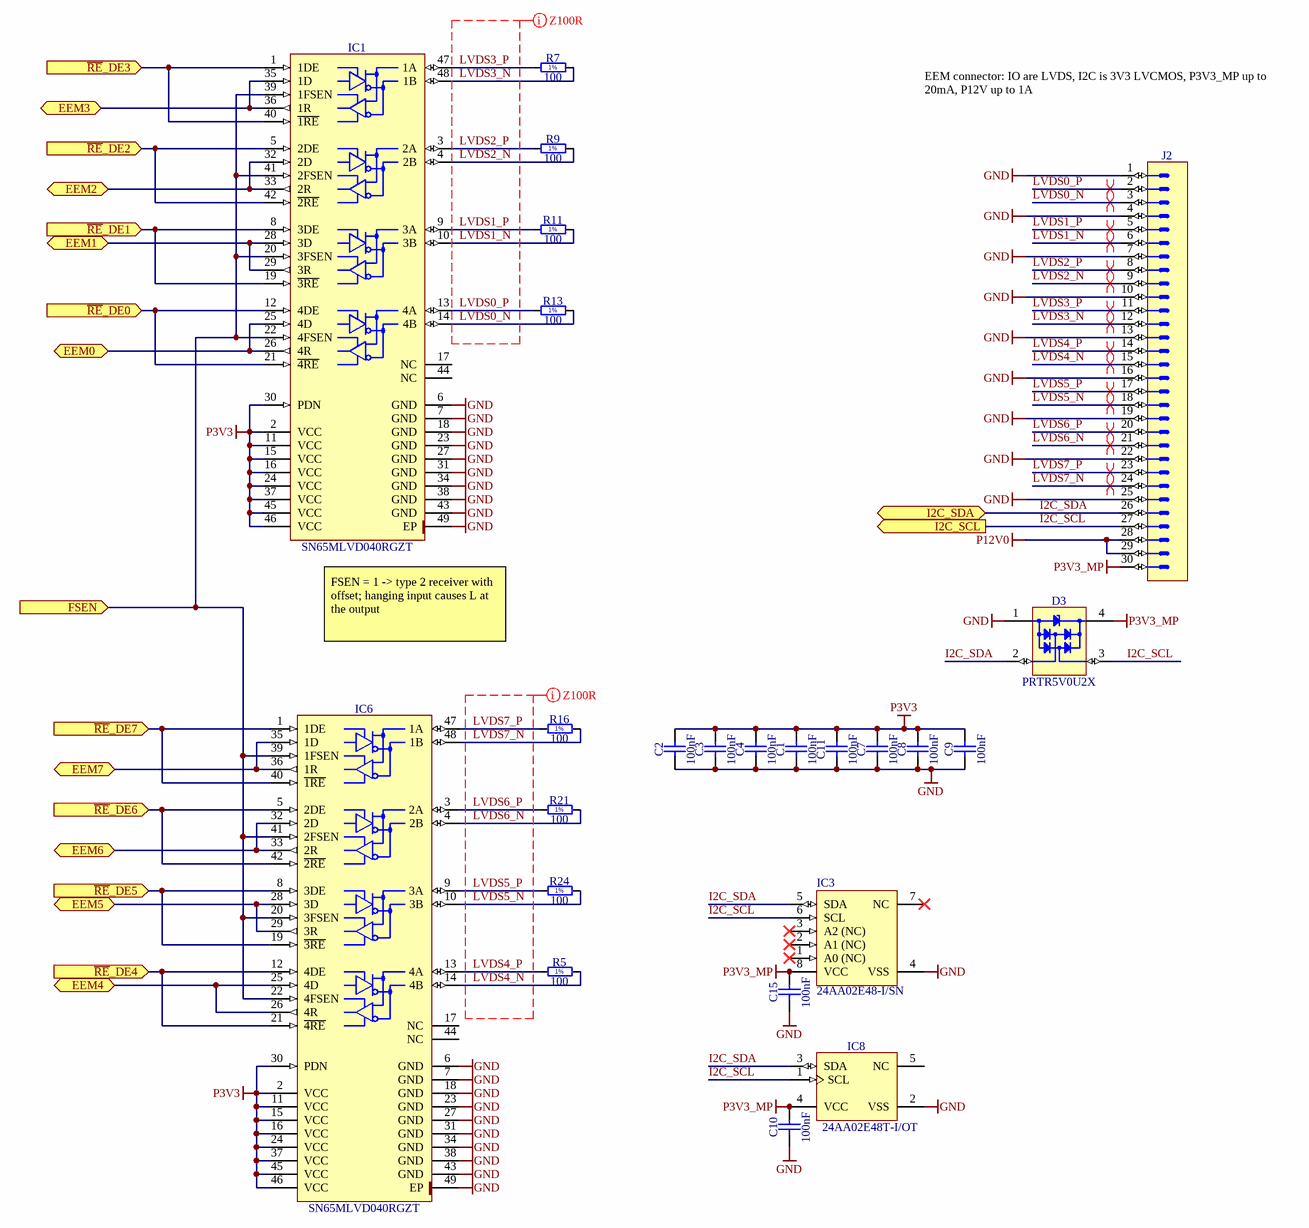
[diagram p2: LVDS_IFC_MCX.SchDoc]

### Parts
C1  100nF  [CAPC1005X55N]
C2  100nF  [CAPC1005X55N]
C3  100nF  [CAPC1005X55N]
C4  100nF  [CAPC1005X55N]
C7  100nF  [CAPC1005X55N]
C8  100nF  [CAPC1005X55N]
C9  100nF  [CAPC1005X55N]
C10  100nF  [CAPC1005X55N]
C11  100nF  [CAPC1005X55N]
C15  100nF  [CAPC1005X55N]
D3  PRTR5V0U2X  [SOT190P230X110-4N]
IC1  SN65MLVD040RGZT  [QFN50P700X700X100-49N-S420]
IC3  24AA02E48-I/SN  [SOIC127]
IC6  SN65MLVD040RGZT  [QFN50P700X700X100-49N-S420]
IC8  24AA02E48T-I/OT  [SOT95P280X145-5N]
J2  (no value)  [3M_N2530-6002RB]
R5  100  [RESC1005X40N]
R7  100  [RESC1005X40N]
R9  100  [RESC1005X40N]
R11  100  [RESC1005X40N]
R13  100  [RESC1005X40N]
R16  100  [RESC1005X40N]
R21  100  [RESC1005X40N]
R24  100  [RESC1005X40N]

### Ports
EEM0 (bidir), EEM1 (bidir), EEM2 (bidir), EEM3 (bidir), EEM4 (bidir), EEM5 (bidir), EEM6 (bidir), EEM7 (bidir), FSEN (in), I2C_SCL (out), I2C_SDA (bidir), ~{RE}_DE0 (in), ~{RE}_DE1 (in), ~{RE}_DE2 (in), ~{RE}_DE3 (in), ~{RE}_DE4 (in), ~{RE}_DE5 (in), ~{RE}_DE6 (in), ~{RE}_DE7 (in)

### Nets
GND: C1.1 C2.1 C3.1 C4.1 C7.1 C8.1 C9.1 C10.1 C11.1 C15.1 D3.1(GND) IC1.6(GND) IC1.7(GND) IC1.18(GND) IC1.23(GND) IC1.27(GND) IC1.31(GND) IC1.34(GND) IC1.38(GND) IC1.43(GND) IC1.49(EP) IC3.4(VSS) IC6.6(GND) IC6.7(GND) IC6.18(GND) IC6.23(GND) IC6.27(GND) IC6.31(GND) IC6.34(GND) IC6.38(GND) IC6.43(GND) IC6.49(EP) IC8.2(VSS) J2.1 J2.4 J2.7 J2.10 J2.13 J2.16 J2.19 J2.22 J2.25
P3V3: C1.2 C2.2 C3.2 C4.2 C7.2 C8.2 C9.2 C11.2 IC1.2(VCC) IC1.11(VCC) IC1.15(VCC) IC1.16(VCC) IC1.24(VCC) IC1.30(PDN) IC1.37(VCC) IC1.45(VCC) IC1.46(VCC) IC6.2(VCC) IC6.11(VCC) IC6.15(VCC) IC6.16(VCC) IC6.24(VCC) IC6.30(PDN) IC6.37(VCC) IC6.45(VCC) IC6.46(VCC)
P3V3_MP: C10.2 C15.2 D3.4(VCC) IC3.8(VCC) IC8.4(VCC) J2.30
P12V0: J2.28 J2.29
EEM0: IC1.25(4D) IC1.26(4R) ; port EEM0
EEM1: IC1.28(3D) IC1.29(3R) ; port EEM1
EEM2: IC1.32(2D) IC1.33(2R) ; port EEM2
EEM3: IC1.35(1D) IC1.36(1R) ; port EEM3
EEM4: IC6.25(4D) IC6.26(4R) ; port EEM4
EEM5: IC6.28(3D) IC6.29(3R) ; port EEM5
EEM6: IC6.32(2D) IC6.33(2R) ; port EEM6
EEM7: IC6.35(1D) IC6.36(1R) ; port EEM7
FSEN: IC1.20(3FSEN) IC1.22(4FSEN) IC1.39(1FSEN) IC1.41(2FSEN) IC6.20(3FSEN) IC6.22(4FSEN) IC6.39(1FSEN) IC6.41(2FSEN) ; port FSEN
I2C_SCL: D3.3(I/O2) IC3.6(SCL) IC8.1(SCL) J2.27 ; port I2C_SCL
I2C_SDA: D3.2(I/O1) IC3.5(SDA) IC8.3(SDA) J2.26 ; port I2C_SDA
LVDS0_N: IC1.14(4B) J2.3 R13.2
LVDS0_P: IC1.13(4A) J2.2 R13.1
LVDS1_N: IC1.10(3B) J2.6 R11.2
LVDS1_P: IC1.9(3A) J2.5 R11.1
LVDS2_N: IC1.4(2B) J2.9 R9.2
LVDS2_P: IC1.3(2A) J2.8 R9.1
LVDS3_N: IC1.48(1B) J2.12 R7.2
LVDS3_P: IC1.47(1A) J2.11 R7.1
LVDS4_N: IC6.14(4B) J2.15 R5.2
LVDS4_P: IC6.13(4A) J2.14 R5.1
LVDS5_N: IC6.10(3B) J2.18 R24.2
LVDS5_P: IC6.9(3A) J2.17 R24.1
LVDS6_N: IC6.4(2B) J2.21 R21.2
LVDS6_P: IC6.3(2A) J2.20 R21.1
LVDS7_N: IC6.48(1B) J2.24 R16.2
LVDS7_P: IC6.47(1A) J2.23 R16.1
~{RE}_DE0: IC1.12(4DE) IC1.21(~{4RE}) ; port ~{RE}_DE0
~{RE}_DE1: IC1.8(3DE) IC1.19(~{3RE}) ; port ~{RE}_DE1
~{RE}_DE2: IC1.5(2DE) IC1.42(~{2RE}) ; port ~{RE}_DE2
~{RE}_DE3: IC1.1(1DE) IC1.40(~{1RE}) ; port ~{RE}_DE3
~{RE}_DE4: IC6.12(4DE) IC6.21(~{4RE}) ; port ~{RE}_DE4
~{RE}_DE5: IC6.8(3DE) IC6.19(~{3RE}) ; port ~{RE}_DE5
~{RE}_DE6: IC6.5(2DE) IC6.42(~{2RE}) ; port ~{RE}_DE6
~{RE}_DE7: IC6.1(1DE) IC6.40(~{1RE}) ; port ~{RE}_DE7

Not connected (* = marked no-connect by the designer): IC1 17(NC) 44(NC); IC3 1(A0_(NC))* 2(A1_(NC))* 3(A2_(NC))* 7(NC)*; IC6 17(NC) 44(NC); IC8 5(NC)

### Channels
U_LVDS_IFCA: designators end in _U_LVDS_IFCA; ports EEM0=IO0 EEM1=IO1 EEM2=IO2 EEM3=IO3 EEM4=IO4 EEM5=IO5 EEM6=IO6 EEM7=IO7 FSEN=FSEN I2C_SCL=I2C_SCL I2C_SDA=I2C_SDA ~{RE}_DE0=DIR_CTRL0 ~{RE}_DE1=DIR_CTRL0 ~{RE}_DE2=DIR_CTRL0 ~{RE}_DE3=DIR_CTRL0 ~{RE}_DE4=DIR_CTRL1 ~{RE}_DE5=DIR_CTRL1 ~{RE}_DE6=DIR_CTRL1 ~{RE}_DE7=DIR_CTRL1
U_LVDS_IFCB: designators end in _U_LVDS_IFCB; ports EEM0=IO8 EEM1=IO9 EEM2=IO10 EEM3=IO11 EEM4=IO12 EEM5=IO13 EEM6=IO14 EEM7=IO15 FSEN=FSEN I2C_SCL=I2C_SCL_U_LVDS_IFCB I2C_SDA=I2C_SDA_U_LVDS_IFCB ~{RE}_DE0=DIR_CTRL2 ~{RE}_DE1=DIR_CTRL2 ~{RE}_DE2=DIR_CTRL2 ~{RE}_DE3=DIR_CTRL2 ~{RE}_DE4=DIR_CTRL3 ~{RE}_DE5=DIR_CTRL3 ~{RE}_DE6=DIR_CTRL3 ~{RE}_DE7=DIR_CTRL3

### Layout directives
differential pair: LVDS0_N_U_LVDS_IFCA, LVDS0_P_U_LVDS_IFCA, LVDS1_N_U_LVDS_IFCA, LVDS1_P_U_LVDS_IFCA, LVDS2_N_U_LVDS_IFCA, LVDS2_P_U_LVDS_IFCA, LVDS3_N_U_LVDS_IFCA, LVDS3_P_U_LVDS_IFCA, LVDS4_N_U_LVDS_IFCA, LVDS4_P_U_LVDS_IFCA, LVDS5_N_U_LVDS_IFCA, LVDS5_P_U_LVDS_IFCA, LVDS6_N_U_LVDS_IFCA, LVDS6_P_U_LVDS_IFCA, LVDS7_N_U_LVDS_IFCA, LVDS7_P_U_LVDS_IFCA
net class Z100R: LVDS0_N, LVDS0_P, LVDS1_N, LVDS1_P, LVDS2_N, LVDS2_P, LVDS3_N, LVDS3_P, LVDS4_N, LVDS4_P, LVDS5_N, LVDS5_P, LVDS6_N, LVDS6_P, LVDS7_N, LVDS7_P

### Notes on the sheet
- (near J2) EEM connector: IO are LVDS, I2C is 3V3 LVCMOS, P3V3_MP up to 20mA, P12V up to 1A
- (near IC1) FSEN = 1 -> type 2 receiver with offset; hanging input causes L at the output
- Project/Equipment
- Document
- Designer
- Drawn by
- Check.by
- Copyright WUT ISE 2018.
  This documentation describes Open Hardware and is licensed under the CERN OHL v.1.1. You may redistribute and modify this documentation under the terms of the CERN OHL v.1.1. (http://ohwr.org/CERNOHL). This documentation is distributed WITHOUT ANY EXPRESS OR IMPLIED WARRANTY, INCLUDING OF MERCHANTABILITY, SATISFACTORY QUALITY AND FITNESS FOR A PARTICULAR PURPOSE. Please see the CERN OHL v.1.1 for applicable conditions.
- Contact
- File
- Last Mod.
- Print Date
- Sheet
- Size
- A3
- of
- Rev
- (in symbol R0402_100R_1%_0.1W_100PPM) 1%

### Library data of the parts
C1-C4 C7-C11 C15 = CC0402_100NF_16V_10%_X5R: as C37 on sheet DIO_MCX; Part Number: CC0402_100NF_16V_10%_X5R; Component Kind: Standard; Component Type: Standard; Pin Count: 2; Value: 100nF; Status: None; Manufacturer Part Number: CC0402_100NF_16V_10%_X5R; Case: 0402; Mounted: Yes; Socket: No; SMD: Yes; Sense: No; Manufacturer1 Example: MURATA; Manufacturer1 ComponentHeight: 0.55mm; HelpURL: \\cern.ch\dfs\Applications\Altium\Datasheets\CC0402_X5R_MURATA_GRM.pdf; Author: CERN DEM JLC; CreateDate: 10.12.2013; LatestRevisionDate: 10.12.2013
D3 = PRTR5V0U2X: Ultra Low Capacitance Double Rail-to-Rail ESD Protection Diode; Part Description: Ultra Low Capacitance (1pF) Double Rail-to-Rail ESD Protection Diode (8kV); Manufacturer: NXP SEMICONDUCTORS; Voltage: 5.5V; PressFit: No; Bonding: No; Part Number: PRTR5V0U2X; Component Kind: Standard; Component Type: Standard; Device: PRTR5V0U2X; PackageDescription: SOT143B, SOT, 1.90mm Pitch; 4 Pin, 1.30mm W X 2.90mm L X 1.10mm H body, IPC Medium Density; Manufacturer Part Number: PRTR5V0U2X; Pin Count: 4; Case: SOT143B; Mounted: Yes; Socket: No; SMD: Yes; Sense: No; ComponentHeight: 1.1mm; HelpURL: \\cern.ch\dfs\Applications\Altium\Datasheets\PRTR5V0U2X.pdf; Author: CERN DEM JLC; CreateDate: 22.03.2011; LatestRevisionDate: 22.03.2011
IC1 IC6 = SN65MLVD040RGZT: 4-Channel Half-Duplex M-LVDS Line Transceiver; Manufacturer: TEXAS INSTRUMENTS; PressFit: No; Bonding: No; Part Number: SN65MLVD040RGZT; Component Kind: Standard; Component Type: Standard; Device: SN65MLVD040RGZT; PackageDescription: QFN, 0.50mm Pitch, Square; 48 Pin, 7.00mm L X 7.00mm W X 1mm H body (W/Thermal Tab 4.2mm X 4.2mm), IPC Medium Density; Part Description: 4-Channel Half-Duplex M-LVDS Line Transceiver; Manufacturer Part Number: SN65MLVD040RGZT; Pin Count: 49; Case: QFN48; Mounted: Yes; Socket: No; SMD: Yes; Sense: No; ComponentHeight: 1mm; Author: CERN DEM JLC; HelpURL: \\cern.ch\dfs\Applications\Altium\Datasheets\SN65MLVD040RGZT.pdf; CreateDate: 17.03.2011; LatestRevisionDate: 17.03.2011
IC3 = 24AA02E48-I/SN: 1.7V-5.5V, 2K I2C™ Serial EEPROMs with EUI-48™ Node Identity; Manufacturer Part Number: 24AA02E48-I/SN; Value: *
IC8 = 24AA02E48T-I/OT: 1.7V-5.5V, 2K I2C Serial EEPROM With EUI-48 Node Identity; Manufacturer: MICROCHIP TECHNOLOGY; PressFit: No; Bonding: No; Part Number: 24AA02E48T-I/OT; Component Kind: Standard; Component Type: Standard; Device: 24AA02E48T-I/OT; PackageDescription: SOT, 0.95mm pitch; 5 pin, 1.60mm W X 2.90mm L X 1.45mm H body, IPC Medium Density; Part Description: 1.7V-5.5V, 2K I2C Serial EEPROM With EUI-48 Node Identity; Manufacturer Part Number: 24AA02E48T-I/OT; Pin Count: 5; Case: SOT23-5; Mounted: Yes; Socket: No; SMD: Yes; Sense: No; ComponentHeight: 1.45mm; HelpURL: \\cern.ch\dfs\Applications\Altium\Datasheets\24AA02E48T-I-OT.pdf; Author: CERN DEM MR; CreateDate: 31.03.2016; LatestRevisionDate: 31.03.2016
J2 = 3M_N2530-6002RB: as J1 on sheet DIO_MCX; Part Number: 3M_N2530-6002RB; Component Kind: Standard; Component Type: Standard; Pin Count: 30; Family: Header 30; Mounted: Yes; Socket: No; SMD: No; Sense: No; Status: None; Manufacturer Part Number: N2530-6002RB; ComponentHeight: 10.03mm; HelpURL: \\cern.ch\dfs\Applications\Altium\Datasheets\3M_N2530-6002RB.pdf; Author: CERN DEM JLC; CreateDate: 11.02.2009; LatestRevisionDate: 11.08.2009
R5 R7 R9 R11 R13 R16 R21 R24 = R0402_100R_1%_0.1W_100PPM: Resistor - 1%; Part Description: General Purpose Thick Film Chip Resistor; Manufacturer: GENERIC; Manufacturer Part Number: R0402_100R_1%_0.1W_100PPM_50V; Manufacturer1 Part Number: ERJ2RKF1000X; Power: 0.1W; TC: ±100ppm/°C; Voltage: 50V; Part Number: R0402_100R_1%_0.1W_100PPM; Component Kind: Standard; Component Type: Standard; Pin Count: 2; Value: 100; Status: Not recommended; Tolerance: ±1%; Case: 0402; Mounted: Yes; Sense: No; Socket: No; SMD: Yes; Manufacturer1 Example: PANASONIC; Manufacturer1 ComponentHeight: 0.4mm; HelpURL: \\cern.ch\dfs\Applications\Altium\Datasheets\R0402_PANASONIC_ERJ2RK.pdf; Author: CERN DEM JLC; CreateDate: 12.12.2013; LatestRevisionDate: 03.03.2015